# EAGLE design AutoPilotPanel - Part 1 (EAGLE 8.3.1)
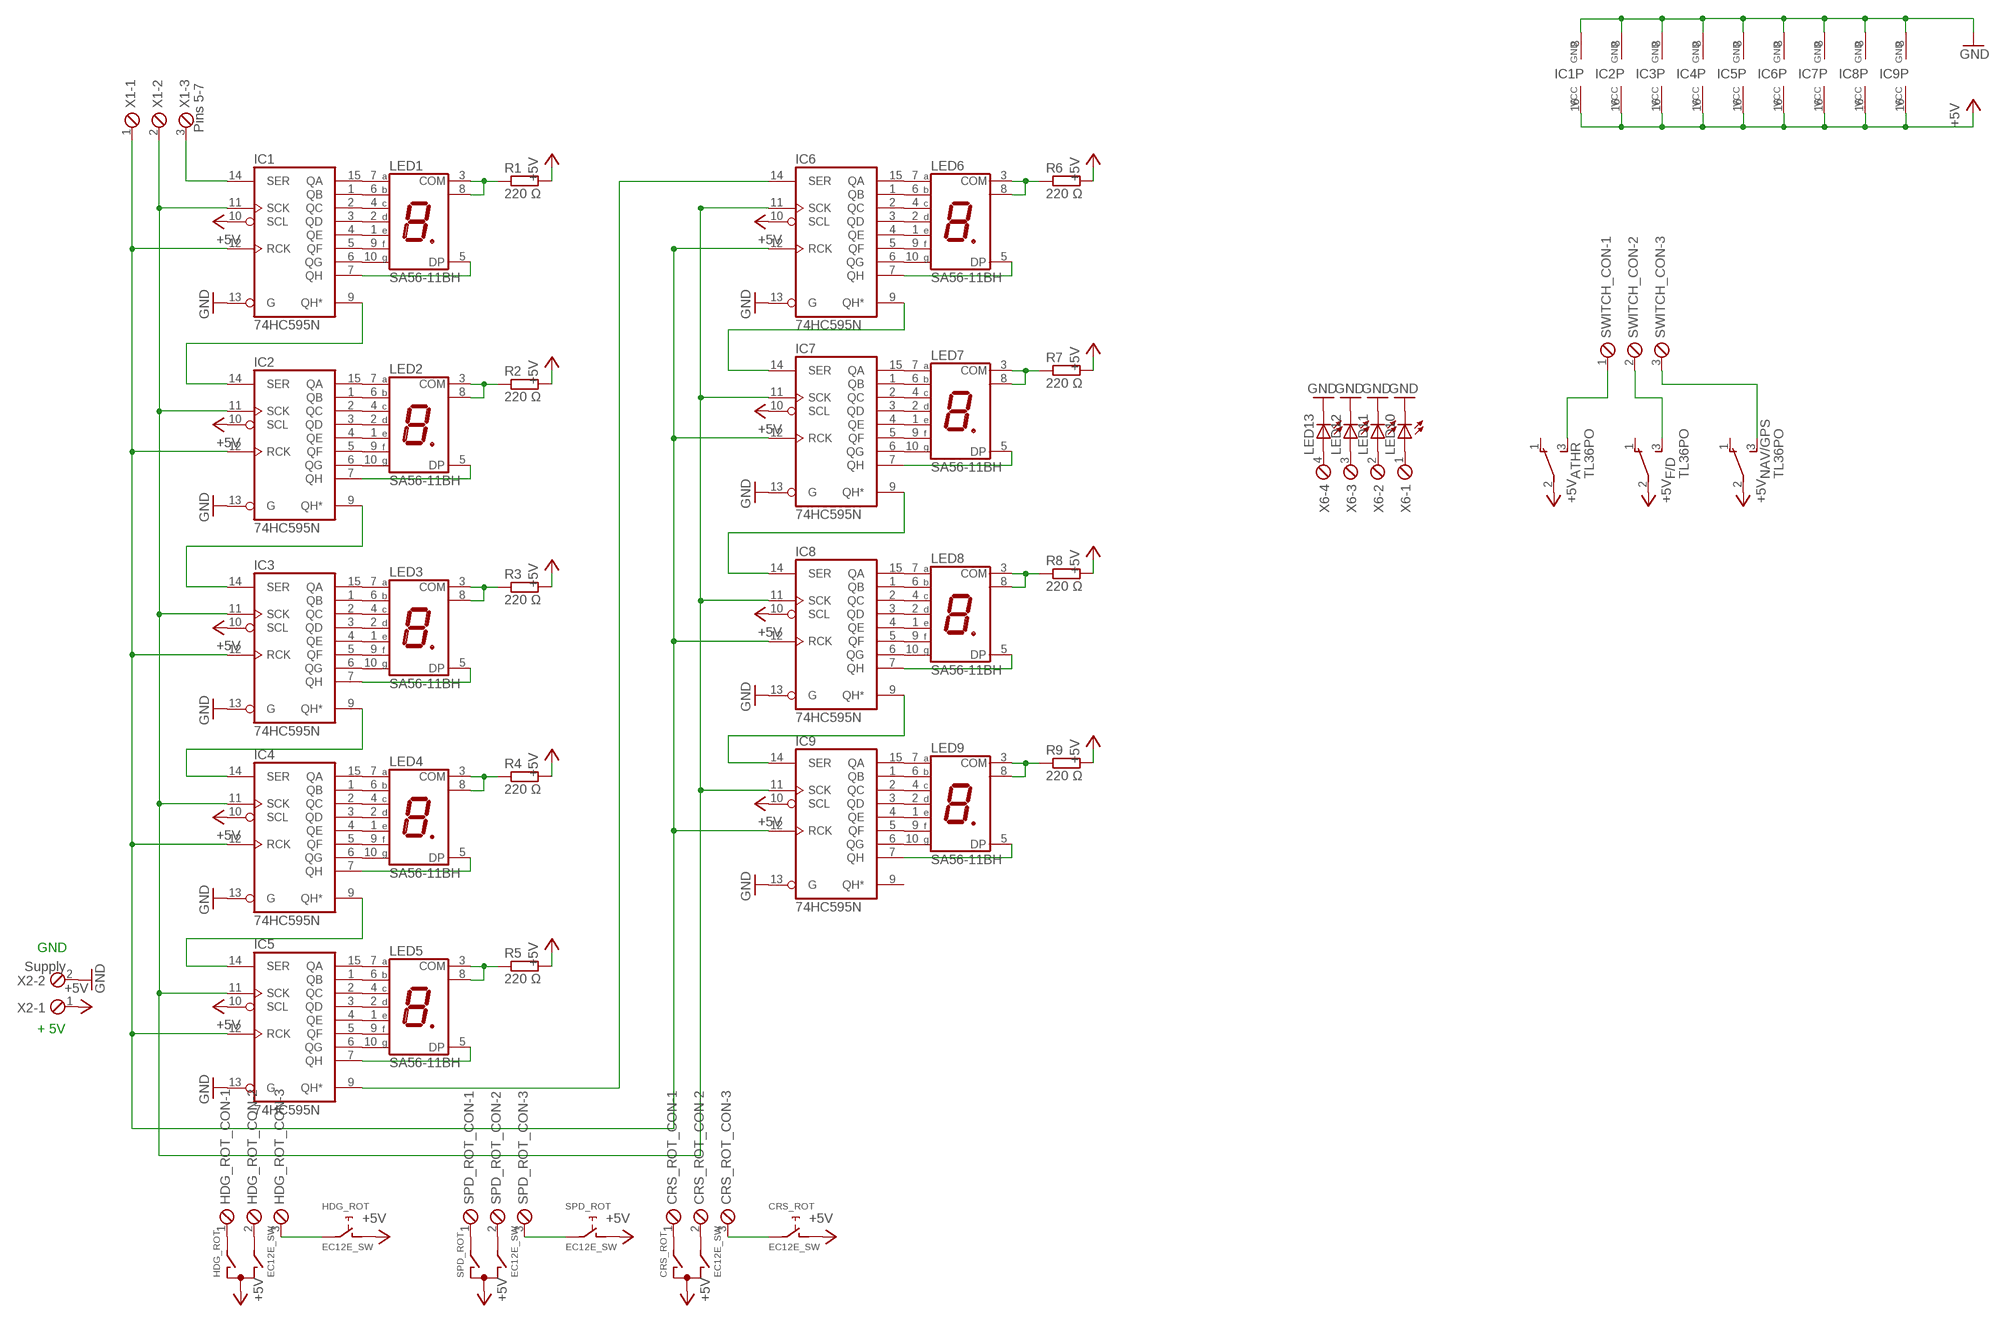
[diagram p0: schematic, sheet 1]

## Parts
ATHR  TL36PO  [TL3XPO]
CRS_ROT  EC12E_SW  [ALPS_EC12E_SW]
CRS_ROT_CON  MPT3  [3POL254]
F/D  TL36PO  [TL3XPO]
HDG_ROT  EC12E_SW  [ALPS_EC12E_SW]
HDG_ROT_CON  MPT3  [3POL254]
IC1  74HC595N  [DIL16]
IC2  74HC595N  [DIL16]
IC3  74HC595N  [DIL16]
IC4  74HC595N  [DIL16]
IC5  74HC595N  [DIL16]
IC6  74HC595N  [DIL16]
IC7  74HC595N  [DIL16]
IC8  74HC595N  [DIL16]
IC9  74HC595N  [DIL16]
LED1  SA56-11BH  7-SEG_SA56-11  [SA56-11]
LED2  SA56-11BH  7-SEG_SA56-11  [SA56-11]
LED3  SA56-11BH  7-SEG_SA56-11  [SA56-11]
LED4  SA56-11BH  7-SEG_SA56-11  [SA56-11]
LED5  SA56-11BH  7-SEG_SA56-11  [SA56-11]
LED6  SA56-11BH  7-SEG_SA56-11  [SA56-11]
LED7  SA56-11BH  7-SEG_SA56-11  [SA56-11]
LED8  SA56-11BH  7-SEG_SA56-11  [SA56-11]
LED9  SA56-11BH  7-SEG_SA56-11  [SA56-11]
LED10  LED5MM  [LED5MM]
LED11  LED5MM  [LED5MM]
LED12  LED5MM  [LED5MM]
LED13  LED5MM  [LED5MM]
NAV/GPS  TL36PO  [TL3XPO]
R1  220 Ω  R-EU_0207/12  [0207/12]
R2  220 Ω  R-EU_0207/12  [0207/12]
R3  220 Ω  R-EU_0207/12  [0207/12]
R4  220 Ω  R-EU_0207/12  [0207/12]
R5  220 Ω  R-EU_0207/12  [0207/12]
R6  220 Ω  R-EU_0207/12  [0207/12]
R7  220 Ω  R-EU_0207/12  [0207/12]
R8  220 Ω  R-EU_0207/12  [0207/12]
R9  220 Ω  R-EU_0207/12  [0207/12]
SPD_ROT  EC12E_SW  [ALPS_EC12E_SW]
SPD_ROT_CON  MPT3  [3POL254]
SWITCH_CON  MPT3  [3POL254]
X1  Pins 5-7  MPT3  [3POL254]
X2  Supply  MPT2  [2POL254]
X6  MPT4  [4POL254]

## Nets
+5V: ATHR.2(P) CRS_ROT.C CRS_ROT.D F/D.2(P) HDG_ROT.C HDG_ROT.D IC1.10(SCL) IC1.16(VCC) IC2.10(SCL) IC2.16(VCC) IC3.10(SCL) IC3.16(VCC) IC4.10(SCL) IC4.16(VCC) IC5.10(SCL) IC5.16(VCC) IC6.10(SCL) IC6.16(VCC) IC7.10(SCL) IC7.16(VCC) IC8.10(SCL) IC8.16(VCC) IC9.10(SCL) IC9.16(VCC) NAV/GPS.2(P) R1.2 R2.2 R3.2 R4.2 R5.2 R6.2 R7.2 R8.2 R9.2 SPD_ROT.C SPD_ROT.D X2.1
GND: IC1.8(GND) IC1.13(G) IC2.8(GND) IC2.13(G) IC3.8(GND) IC3.13(G) IC4.8(GND) IC4.13(G) IC5.8(GND) IC5.13(G) IC6.8(GND) IC6.13(G) IC7.8(GND) IC7.13(G) IC8.8(GND) IC8.13(G) IC9.8(GND) IC9.13(G) LED10.K(C) LED11.K(C) LED12.K(C) LED13.K(C) X2.2
N$1: IC1.5(QF) LED1.9(F)
N$2: IC1.3(QD) LED1.2(D)
N$3: IC1.1(QB) LED1.6(B)
N$4: IC1.15(QA) LED1.7(A)
N$5: IC1.2(QC) LED1.4(C)
N$6: IC1.4(QE) LED1.1(E)
N$7: IC1.6(QG) LED1.10(G)
N$8: IC2.5(QF) LED2.9(F)
N$9: IC1.7(QH) LED1.5(DP)
N$10: IC2.3(QD) LED2.2(D)
N$11: IC2.1(QB) LED2.6(B)
N$12: IC1.14(SER) X1.3
N$13: IC1.11(SCK) IC2.11(SCK) IC3.11(SCK) IC4.11(SCK) IC5.11(SCK) IC6.11(SCK) IC7.11(SCK) IC8.11(SCK) IC9.11(SCK) X1.2
N$14: IC1.12(RCK) IC2.12(RCK) IC3.12(RCK) IC4.12(RCK) IC5.12(RCK) IC6.12(RCK) IC7.12(RCK) IC8.12(RCK) IC9.12(RCK) X1.1
N$15: LED1.3(COM) LED1.8(COM) R1.1
N$16: IC2.15(QA) LED2.7(A)
N$17: IC2.2(QC) LED2.4(C)
N$18: IC2.4(QE) LED2.1(E)
N$19: IC2.6(QG) LED2.10(G)
N$20: IC3.5(QF) LED3.9(F)
N$21: IC3.3(QD) LED3.2(D)
N$22: IC2.7(QH) LED2.5(DP)
N$23: IC1.9(QH*) IC2.14(SER)
N$24: IC3.1(QB) LED3.6(B)
N$25: IC3.15(QA) LED3.7(A)
N$26: LED2.3(COM) LED2.8(COM) R2.1
N$27: IC3.2(QC) LED3.4(C)
N$28: IC3.4(QE) LED3.1(E)
N$29: IC3.6(QG) LED3.10(G)
N$30: IC4.5(QF) LED4.9(F)
N$31: IC4.3(QD) LED4.2(D)
N$32: IC4.1(QB) LED4.6(B)
N$33: IC4.15(QA) LED4.7(A)
N$34: IC4.2(QC) LED4.4(C)
N$35: IC4.4(QE) LED4.1(E)
N$36: IC4.6(QG) LED4.10(G)
N$37: IC5.5(QF) LED5.9(F)
N$38: IC5.3(QD) LED5.2(D)
N$39: IC5.1(QB) LED5.6(B)
N$40: IC5.15(QA) LED5.7(A)
N$41: IC5.2(QC) LED5.4(C)
N$42: IC3.7(QH) LED3.5(DP)
N$43: IC2.9(QH*) IC3.14(SER)
N$44: IC5.4(QE) LED5.1(E)
N$45: IC5.6(QG) LED5.10(G)
N$46: LED3.3(COM) LED3.8(COM) R3.1
N$47: IC6.5(QF) LED6.9(F)
N$48: IC6.3(QD) LED6.2(D)
N$49: IC6.1(QB) LED6.6(B)
N$50: IC6.15(QA) LED6.7(A)
N$51: IC6.2(QC) LED6.4(C)
N$52: IC6.4(QE) LED6.1(E)
N$53: IC6.6(QG) LED6.10(G)
N$54: IC7.5(QF) LED7.9(F)
N$55: IC7.3(QD) LED7.2(D)
N$56: IC7.1(QB) LED7.6(B)
N$57: IC7.15(QA) LED7.7(A)
N$58: IC7.2(QC) LED7.4(C)
N$59: IC7.4(QE) LED7.1(E)
N$60: IC7.6(QG) LED7.10(G)
N$61: IC8.5(QF) LED8.9(F)
N$62: IC4.7(QH) LED4.5(DP)
N$63: IC3.9(QH*) IC4.14(SER)
N$64: IC8.3(QD) LED8.2(D)
N$65: IC8.1(QB) LED8.6(B)
N$66: LED4.3(COM) LED4.8(COM) R4.1
N$67: IC8.15(QA) LED8.7(A)
N$68: IC8.2(QC) LED8.4(C)
N$69: IC8.4(QE) LED8.1(E)
N$70: IC8.6(QG) LED8.10(G)
N$71: IC9.5(QF) LED9.9(F)
N$72: IC9.3(QD) LED9.2(D)
N$73: IC9.1(QB) LED9.6(B)
N$74: IC9.15(QA) LED9.7(A)
N$75: IC9.2(QC) LED9.4(C)
N$76: IC9.4(QE) LED9.1(E)
N$77: IC9.6(QG) LED9.10(G)
N$78: LED10.A X6.1
N$79: LED11.A X6.2
N$80: LED12.A X6.3
N$81: LED13.A X6.4
N$82: IC5.7(QH) LED5.5(DP)
N$83: IC4.9(QH*) IC5.14(SER)
N$84: ATHR.3(S) SWITCH_CON.1
N$85: F/D.3(S) SWITCH_CON.2
N$86: LED5.3(COM) LED5.8(COM) R5.1
N$87: NAV/GPS.3(S) SWITCH_CON.3
N$88: SPD_ROT.A SPD_ROT_CON.1
N$89: SPD_ROT.B SPD_ROT_CON.2
N$90: SPD_ROT.E SPD_ROT_CON.3
N$102: IC6.7(QH) LED6.5(DP)
N$103: IC5.9(QH*) IC6.14(SER)
N$106: LED6.3(COM) LED6.8(COM) R6.1
N$109: CRS_ROT.A CRS_ROT_CON.1
N$110: CRS_ROT.B CRS_ROT_CON.2
N$122: IC7.7(QH) LED7.5(DP)
N$123: IC6.9(QH*) IC7.14(SER)
N$126: LED7.3(COM) LED7.8(COM) R7.1
N$142: IC8.7(QH) LED8.5(DP)
N$143: IC7.9(QH*) IC8.14(SER)
N$146: LED8.3(COM) LED8.8(COM) R8.1
N$162: IC9.7(QH) LED9.5(DP)
N$163: IC8.9(QH*) IC9.14(SER)
N$166: LED9.3(COM) LED9.8(COM) R9.1
N$170: CRS_ROT.E CRS_ROT_CON.3
N$210: HDG_ROT.A HDG_ROT_CON.1
N$211: HDG_ROT.B HDG_ROT_CON.2
N$212: HDG_ROT.E HDG_ROT_CON.3
Unconnected: ATHR.1(O) CRS_ROT.GND1(G) CRS_ROT.GND2(G) F/D.1(O) HDG_ROT.GND1(G) HDG_ROT.GND2(G) IC9.9(QH*) NAV/GPS.1(O) SPD_ROT.GND1(G) SPD_ROT.GND2(G)

## Notes on the sheet
- GND
- + 5V

## Library data of the parts
ATHR F/D NAV/GPS = switch:TL36PO: TINY SWITCH ON - ON Source: http://www2.produktinfo.conrad.com/datenblaetter/700000-724999/705152-da-01-de-Subminiaturschalter_TL_36YO.pdf
CRS_ROT HDG_ROT SPD_ROT = switch-alps:EC12E_SW: ALPS rotary Encoder EC12E series with switch; MPN: EC12E2424407; OC_FARNELL: 1520813; OC_NEWARK: 74M1068
CRS_ROT_CON HDG_ROT_CON SPD_ROT_CON SWITCH_CON X1 = con-phoenix-254:MPT3: PHOENIX CONNECTOR; OC_FARNELL: unknown; OC_NEWARK: unknown
IC1-IC9 = 74xx-eu:74*595: 8-bit SHIFT REGISTER, output latch
LED1-LED9 = display-kingbright:7-SEG_: Kingbright 14.2mm (0.56 INCH) SINGLE DIGIT NUMERIC DUISPLAY Source: SA56-11EWA(Ver1189471036.pdf; OC_FARNELL: unknown; OC_NEWARK: unknown
LED10-LED13 = led:LED: LED OSRAM: - CHIPLED LG R971, LG N971, LY N971, LG Q971, LY Q971, LO R971, LY R971 LH N974, LH R974 LS Q976, LO Q976, LY Q976 LO Q996 - Hyper CHIPLED LW Q18S LB Q993, LB Q99A, LB R99A - SideLED LS A670, LO A670, LY A670, LG A670, LP A670 LB A673, LV A673, LT A673, LW A673 LH A674 LY A675 LS A676, LA A676, LO A676, LY A676, LW A676 LS A679, LY A679, LG A679 - Hyper Micro SIDELED® LS Y876, LA Y876, LO Y876, LY Y876 LT Y87S - SmartLED LW L88C, LW L88S LB L89C, LB L89S, LG L890 LS L89K, LO L89K, LY L89K LS L896, LA L896, LO L896, LY L896 - TOPLED LS T670, LO T670, LY T670, LG T670, LP T670 LSG T670, LSP T670, LSY T670, LOP T670, LYG T670 LG T671, LOG T671, LSG T671 LB T673, LV T673, LT T673, LW T673 LH T674 LS T676, LA T676, LO T676, LY T676, LB T676, LH T676, LSB T676, LW T676 LB T67C, LV T67C, LT T67C, LS T67K, LO T67K, LY T67K, LW E67C LS E67B, LA E67B, LO E67B, LY E67B, LB E67C, LV E67C, LT E67C LW T67C LS T679, LY T679, LG T679 LS T770, LO T770, LY T770, LG T770, LP T770 LB T773, LV T773, LT T773, LW T773 LH T774 LS E675, LA E675, LY E675, LS T675 LS T776, LA T776, LO T776, LY T776, LB T776 LHGB T686 LT T68C, LB T68C - Hyper Mini TOPLED® LB M676 - Mini TOPLED Santana® LG M470 LS M47K, LO M47K, LY M47K Source: http://www.osram.convergy.de LUXEON: - LUMILED® LXK2-PW12-R00, LXK2-PW12-S00, LXK2-PW14-U00, LXK2-PW14-V00 LXK2-PM12-R00, LXK2-PM12-S00, LXK2-PM14-U00 LXK2-PE12-Q00, LXK2-PE12-R00, LXK2-PE12-S00, LXK2-PE14-T00, LXK2-PE14-U00 LXK2-PB12-K00, LXK2-PB12-L00, LXK2-PB12-M00, LXK2-PB14-N00, LXK2-PB14-P00, LXK2-PB14-Q00 LXK2-PR12-L00, LXK2-PR12-M00, LXK2-PR14-Q00, LXK2-PR14-R00 LXK2-PD12-Q00, LXK2-PD12-R00, LXK2-PD12-S00 LXK2-PH12-R00, LXK2-PH12-S00 LXK2-PL12-P00, LXK2-PL12-Q00, LXK2-PL12-R00 Source: www.luxeon.com KINGBRIGHT: KA-3528ASYC Source: www.kingbright.com
R1-R9 = resistor:R-EU_: RESISTOR, European symbol
X2 = con-phoenix-254:MPT2: PHOENIX CONNECTOR; OC_FARNELL: unknown; OC_NEWARK: unknown
X6 = con-phoenix-254:MPT4: PHOENIX CONNECTOR; OC_FARNELL: unknown; OC_NEWARK: unknown

## Board
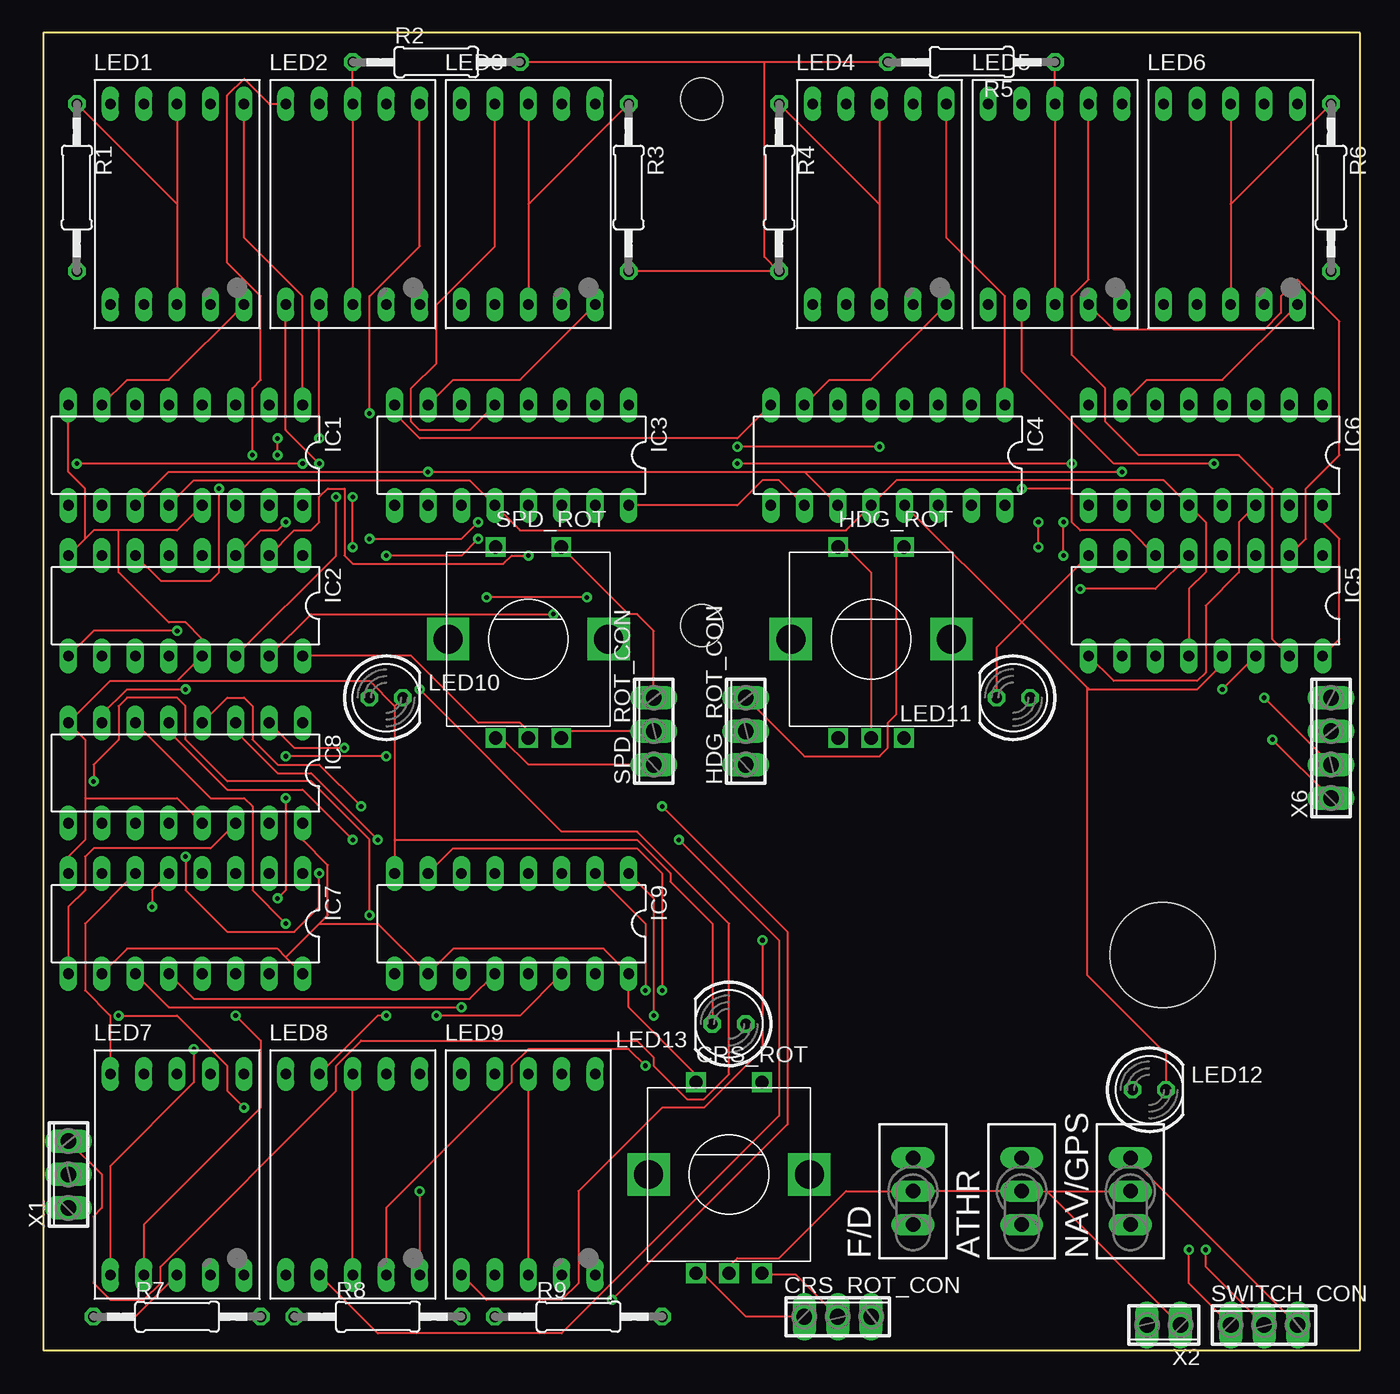
[diagram p1: board, top side]
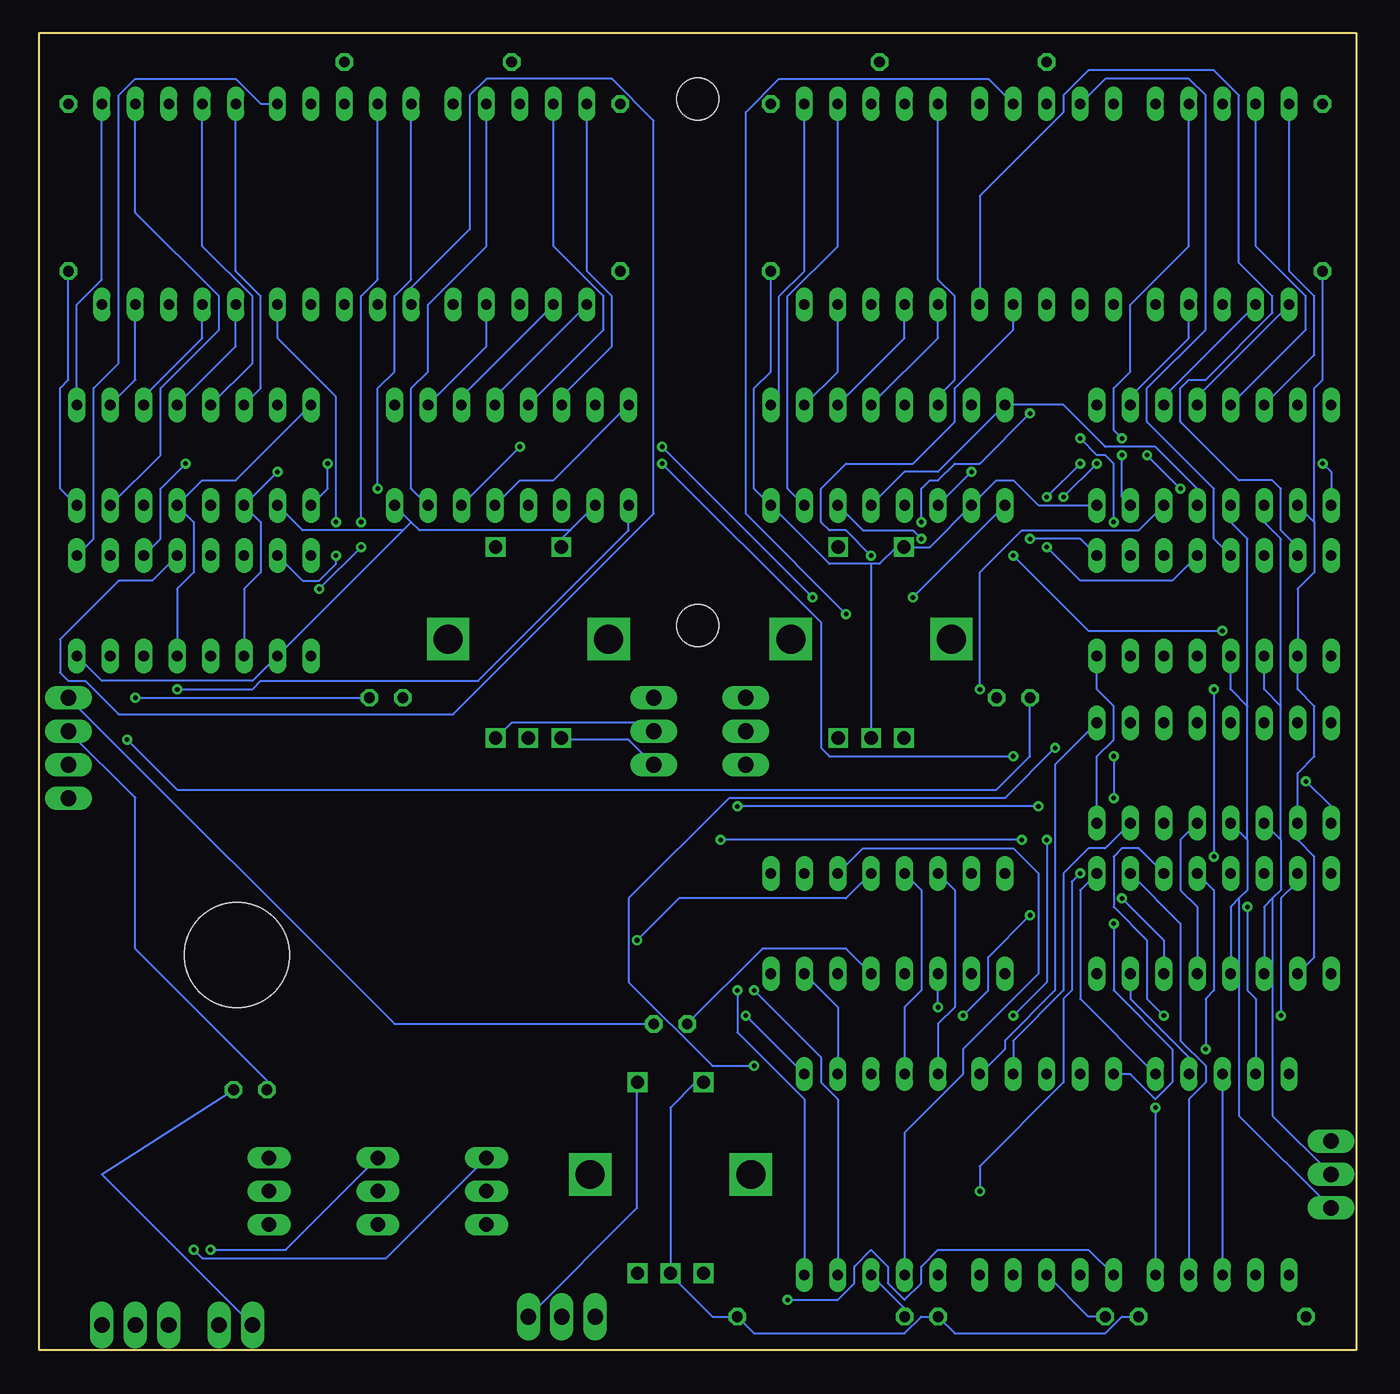
[diagram p2: board, bottom side, seen from below]

Size 100 x 100 mm. Coordinates in mm from the lower left corner, seen from the top.
Outline: 0,0 100,0 100,100 0,100 0,0
Copper layers (1*16): Top 0.035mm / dielectric 1.5mm / Bottom 0.035mm
Design rules "default": minimum track width 6mil, minimum drill 0.35mm, track to track 6mil, track to pad 6mil, pad to pad 6mil, via to via 6mil, smd to smd 6mil, copper to edge 40mil, drill to drill 6mil, minimum pad ring 10mil, minimum via ring 8mil, stop-mask expansion 4mil, vias tented up to drill 0mil, thermal gap 10mil
Holes 3.2 mm at 50,95 50,55
Holes 8 mm at 85,30

### Footprints (pad centres in the part's own frame; a part is rotated, then mirrored left to right if it is on the bottom)
TL3XPO = drill 1.1 pad 1.422 long: 1 -2.54,0; 2 0,0; 3 2.54,0
ALPS_EC12E_SW = drill 1 square: A -2.5,-7.5; B 2.5,-7.5; C 0,-7.5; D -2.5,7; E 2.5,7 | drill 2.2 square: GND1 -6.1,0; GND2 6.1,0
3POL254 = drill 1.2 long: 1 -2.54,0; 2 0,0; 3 2.54,0
DIL16 = drill 0.813 long: 1 -8.89,-3.81; 2 -6.35,-3.81; 3 -3.81,-3.81; 4 -1.27,-3.81; 5 1.27,-3.81; 6 3.81,-3.81; 7 6.35,-3.81; 8 8.89,-3.81; 9 8.89,3.81; 10 6.35,3.81; 11 3.81,3.81; 12 1.27,3.81; 13 -1.27,3.81; 14 -3.81,3.81; 15 -6.35,3.81; 16 -8.89,3.81
SA56-11 = drill 0.8 long: 1 -5.08,-7.62; 2 -2.54,-7.62; 3 0,-7.62; 4 2.54,-7.62; 5 5.08,-7.62; 6 5.08,7.62; 7 2.54,7.62; 8 0,7.62; 9 -2.54,7.62; 10 -5.08,7.62
LED5MM = drill 0.813 octagon: A -1.27,0; K 1.27,0
0207/12 = drill 0.813 octagon: 1 -6.35,0; 2 6.35,0
2POL254 = drill 1.2 long: 1 -1.27,0; 2 1.27,0
4POL254 = drill 1.2 long: 1 -3.81,0; 2 -1.27,0; 3 1.27,0; 4 3.81,0

### Placement (x,y rotation side)
ATHR  74.3,12.06 90 top
CRS_ROT  52.07,13.34 0 top
CRS_ROT_CON  60.33,2.54 0 top
F/D  66.04,12.06 90 top
HDG_ROT  62.87,53.98 0 top
HDG_ROT_CON  53.34,46.99 90 top
IC1  10.79,67.94 180 top
IC2  10.79,56.52 180 top
IC3  35.56,67.94 180 top
IC4  64.14,67.94 180 top
IC5  88.27,56.52 180 top
IC6  88.27,67.94 180 top
IC7  10.79,32.38 180 top
IC8  10.79,43.81 180 top
IC9  35.56,32.38 180 top
LED1  10.16,87 0 top
LED2  23.5,87 0 top
LED3  36.83,87 0 top
LED4  63.5,87 0 top
LED5  76.83,87 0 top
LED6  90.17,87 0 top
LED7  10.16,13.34 0 top
LED8  23.5,13.34 0 top
LED9  36.83,13.34 0 top
LED10  26.04,49.53 0 top
LED11  73.66,49.53 180 top
LED12  83.98,19.77 0 top
LED13  52.07,24.77 180 top
NAV/GPS  82.55,12.06 90 top
R1  2.54,88.27 270 top
R2  29.84,97.79 0 top
R3  44.45,88.27 270 top
R4  55.88,88.27 270 top
R5  70.48,97.79 180 top
R6  97.79,88.27 270 top
R7  10.16,2.54 0 top
R8  25.4,2.54 0 top
R9  40.64,2.54 0 top
SPD_ROT  36.83,53.98 0 top
SPD_ROT_CON  46.35,46.99 90 top
SWITCH_CON  92.71,1.91 0 top
X1  1.91,13.34 90 top
X2  85.09,1.91 180 top
X6  97.79,45.72 90 top

### Tracks (layer width: path | path; a pad name or v marks a point on that pad's centre or on a via)
+5V
  Top 0.152: R3.2 R4.2 55.75,82 54.75,83 54.75,97.79 | R5.2 54.75,97.79 | 54.75,97.79 R2.2 | IC2.16 27.94,52.7 33.02,47.62 36.2,47.62 36.83,46.99 SPD_ROT.C | IC6.16 97.16,62.87 98.42,61.59 98.42,53.98 IC5.16 | HDG_ROT.C 62.87,59.05 60.96,60.96 HDG_ROT.D | IC3.16 52.7,64.14 54.61,66.04 55.88,66.04 IC4.10 | IC7.10 6.35,30.48 17.78,30.48 18.41,29.84 | IC7.16 18.41,29.84 | IC8.16 19.68,38.73 21.59,36.83 21.59,33.02 20.95,32.38 | 18.41,29.84 20.95,32.38 | 20.95,32.38 25.4,32.38 IC9.10 31.11,30.48 42.55,30.48 IC9.16 44.45,26.04 49.53,20.95 CRS_ROT.D | 76.2,12.06 ATHR.2 F/D.2 60.96,12.06 55.88,6.99 52.7,6.99 52.07,6.35 CRS_ROT.C | 76.2,12.06 NAV/GPS.2 | 76.2,12.06 X2.1
  Bottom 0.152: IC1.16 24.13,64.14 26.04,66.04 27.3,66.04 IC3.10 32.38,60.96 34.29,60.96 SPD_ROT.D 34.92,60.96 36.2,59.69 36.83,59.69 | 36.83,59.69 40.01,59.69 IC3.16 45.72,65.41 45.72,73.03 44.45,74.3 R3.2 | 36.83,59.69 SPD_ROT.C | 59.69,62.23 60.33,61.59 HDG_ROT.D | 59.69,62.23 IC4.10 | 71.75,62.87 71.12,62.23 59.69,62.23 | 71.75,62.87 IC4.16 | 71.75,62.87 72.39,62.23 | 72.39,62.23 IC5.10 83.82,50.8 95.25,50.8 IC5.16 | IC6.10 80.01,62.23 72.39,62.23 | R6.2 97.79,73.66 98.42,73.03 98.42,65.41 IC6.16 | 3.17,62.87 3.17,59.05 4.45,57.78 IC2.10 4.45,50.16 3.17,48.9 3.17,45.09 4.45,43.81 IC8.10 4.45,38.73 3.17,37.47 3.17,29.84 IC7.10 | IC1.10 3.17,62.87 | R1.2 2.54,73.66 3.17,73.03 3.17,62.87 | R7.2 17.78,2.54 19.05,1.27 30.48,1.27 R8.2 33.02,2.54 34.29,1.27 45.72,1.27 R9.2 48.9,2.54 52.07,5.71 CRS_ROT.C 52.07,18.41 50.16,20.32 CRS_ROT.D | IC2.16 19.68,50.16 18.41,48.9 18.41,46.35 19.68,45.09 IC8.16
GND
  Top 0.152: 3.17,61.59 3.81,62.23 5.71,62.23 | 3.17,61.59 IC2.8 | 5.71,62.23 10.16,62.23 IC1.13 | IC1.8 1.91,66.67 3.17,65.41 3.17,61.59 | 26.67,48.9 26.67,38.73 | 26.67,38.73 IC9.8 | LED10.K 26.67,48.9 | IC7.8 1.91,37.47 3.17,38.73 3.17,41.91 | 3.17,41.91 3.17,46.35 IC8.8 5.08,50.8 10.16,50.8 | 10.16,50.8 IC2.13 12.06,53.98 10.79,55.24 9.53,55.24 5.71,59.05 5.71,62.23 | IC8.13 10.16,41.91 3.17,41.91 | 26.67,48.9 24.77,50.8 10.16,50.8 | LED13.K 50.8,32.38 47.62,35.56 47.62,36.2 45.09,38.73 26.67,38.73 | LED11.K 72.39,53.34 74.3,55.24 | IC5.8 74.3,55.24 | 74.3,55.24 IC4.13 | IC5.13 89.53,52.07 87.63,50.16 79.38,50.16 79.27,50.27 | 74.3,55.24 79.27,50.27 | IC3.8 26.67,71.12 28.57,69.22 52.7,69.22 IC4.8 | LED12.K 85.25,22.5 79.25,28.5 79.25,50.25 79.27,50.27
  Bottom 0.152: IC3.13 34.29,66.67 31.75,66.67 IC3.8 22.23,71.75 19.05,68.58 15.24,68.58 12.06,65.41 IC1.13 | LED13.K 45.09,30.48 38.73,30.48 IC9.13 | IC7.13 12.06,33.66 13.34,34.92 13.34,38.73 IC8.13 | LED12.K 95.25,13.34 X2.2 | IC5.13 89.53,57.78 88.27,59.05 88.27,62.87 IC6.13 87.63,66.04 85.09,66.04 IC6.8 | IC4.8 60.96,66.04 63.5,66.04 IC4.13
N$1
  Bottom 0.152: LED1.9 7.62,83.82 3.81,80.01 3.81,77.47 IC1.5
N$2
  Bottom 0.152: LED1.2 14.61,72.39 IC1.3
N$3
  Top 0.152: LED1.6 15.24,84.45 19.68,80.01 IC1.1
N$4  (via drill 0.35)
  Top 0.152: v17.78,67.94 v17.78,69.22
  Bottom 0.152: LED1.7 12.7,83.82 17.14,79.38 17.14,74.3 18.41,73.03 18.41,69.85 v17.78,69.22 | v17.78,67.94 17.78,64.77 IC1.15
N$5
  Bottom 0.152: LED1.4 12.7,76.83 17.14,72.39 IC1.2
N$6
  Bottom 0.152: LED1.1 12.06,72.39 IC1.4
N$7
  Bottom 0.152: LED1.10 5.08,81.92 3.17,80.01 3.17,75.56 IC1.6
N$8
  Bottom 0.152: LED2.9 19.05,96.52 12.7,96.52 11.43,95.25 11.43,77.47 15.88,73.03 15.88,70.48 10.79,65.41 10.79,61.59 IC2.5
N$9
  Top 0.152: LED1.5 9.53,73.66 6.35,73.66 IC1.7
N$10  (via drill 0.35)
  Top 0.152: v20.95,69.22 LED2.2 | v18.41,62.87 17.78,62.23 16.51,62.23 IC2.3
  Bottom 0.152: v20.95,69.22 19.68,67.94 19.05,67.94 18.41,67.31 v18.41,62.87
N$11  (via drill 0.35)
  Top 0.152: LED2.6 28.57,83.82 24.77,80.01 v24.77,71.12 | v33.02,62.87 31.75,61.59 v24.77,61.59
  Bottom 0.152: v24.77,71.12 28.57,67.31 30.48,67.31 31.75,66.04 32.38,66.04 33.02,65.41 v33.02,62.87 | v24.77,61.59 20.95,61.59 IC2.1
N$12  (via drill 0.35)
  Top 0.152: v28.57,50.16 39.37,39.37 45.09,39.37 52.07,32.38 52.07,20.95 50.16,19.05 48.9,19.05 46.35,21.59 46.35,22.23 45.09,23.5 24.13,23.5 22.23,21.59 22.23,19.68 8.89,6.35 8.89,5.08 7.62,3.81 5.08,3.81 3.81,5.08 3.81,10.16 4.45,10.79 4.45,13.34 X1.3
  Bottom 0.152: IC1.14 16.51,62.23 25.4,62.23 28.57,59.05 v28.57,50.16
N$13  (via drill 0.35)
  Top 0.152: v31.75,26.04 9.53,26.04 IC7.11 | IC1.11 9.53,66.67 v29.21,66.67 57.78,66.67 | 57.78,66.67 IC4.11 | 57.78,66.67 v81.92,66.67
  Bottom 0.152: IC5.11 84.45,57.78 83.19,59.05 83.19,62.87 IC6.11 v81.92,66.67 | IC7.11 6.99,33.66 6.35,34.29 | 6.35,34.29 5.71,34.92 5.71,38.73 | IC8.11 5.71,38.73 | IC2.11 6.99,50.16 5.71,48.9 | 5.71,38.73 5.71,48.9 | v31.75,26.04 IC9.11 | IC1.11 6.99,62.87 5.71,61.59 5.71,48.9 | v29.21,66.67 IC3.11 | X1.2 6.35,17.78 6.35,34.29
N$14
  Top 0.152: IC5.12 87,57.78 88.27,59.05 88.27,62.87 IC6.12 85.09,66.04 64.77,66.04 IC4.12 60.96,62.23 36.2,62.23 IC3.12 32.38,66.04 11.43,66.04 IC1.12 | IC9.12 32.38,26.67 11.43,26.67 IC7.12
  Bottom 0.152: IC7.12 9.53,33.66 8.89,34.29 | 8.89,34.29 8.26,34.92 8.26,38.73 | IC8.12 8.26,38.73 | IC2.12 9.53,50.16 8.26,48.9 | 8.26,38.73 8.26,48.9 | IC1.12 9.53,62.87 8.26,61.59 8.26,48.9 | X1.1 8.89,17.78 8.89,34.29
N$15
  Top 0.152: LED1.8 10.16,87 | 10.16,87 LED1.3 | 10.16,87 R1.1
N$16  (via drill 0.35)
  Top 0.152: v38.73,55.88 20.32,55.88 IC2.15
  Bottom 0.152: LED2.7 27.94,96.52 43.81,96.52 46.35,93.98 46.35,63.5 v38.73,55.88
N$17  (via drill 0.35)
  Top 0.152: v36.83,60.33 35.56,60.33 34.92,59.69 23.5,59.69 22.86,60.33 22.86,65.41 21.59,65.41 20.95,64.77 20.95,62.87 20.32,62.23 19.05,62.23 IC2.2
  Bottom 0.152: LED2.4 26.04,77.47 30.48,73.03 30.48,70.48 33.66,67.31 38.73,67.31 40.64,65.41 40.64,62.87 40.01,62.23 38.73,62.23 v36.83,60.33
N$18  (via drill 0.35)
  Top 0.152: LED2.1 18.41,69.85 v20.95,67.31 | v23.5,60.96 v23.5,64.77
  Bottom 0.152: v23.5,64.77 v20.95,67.31 | v23.5,60.96 20.95,58.42 13.97,58.42 IC2.4
N$19  (via drill 0.35)
  Top 0.152: LED2.10 17.14,94.61 15.24,96.52 13.97,95.25 13.97,82.55 16.51,80.01 16.51,73.66 15.88,73.03 v15.88,67.94 | v13.34,65.41 13.34,59.05 12.7,58.42 8.89,58.42 IC2.6
  Bottom 0.152: v13.34,65.41 v15.88,67.94
N$20
  Top 0.152: LED3.9 34.29,83.82 29.84,79.38 29.84,74.93 27.94,73.03 27.94,70.48 28.57,69.85 32.38,69.85 IC3.5
N$21
  Bottom 0.152: LED3.2 34.29,76.83 IC3.3
N$22
  Bottom 0.152: LED2.5 28.57,87.63 22.23,93.98 22.23,95.25 20.32,97.16 10.79,97.16 8.89,95.25 8.89,82.55 6.35,80.01 6.35,78.74 11.43,73.66 12.7,73.66 13.34,73.03 13.34,70.48 8.89,66.04 6.35,66.04 5.71,65.41 5.71,62.23 4.45,60.96 IC2.7
N$23  (via drill 0.35)
  Top 0.152: v19.68,67.31 v2.54,67.31 | v22.23,64.77 22.23,60.33 IC2.14
  Bottom 0.152: IC1.9 1.91,66.67 v2.54,67.31 | v22.23,64.77 v19.68,67.31
N$24
  Bottom 0.152: LED3.6 41.91,81.92 43.81,80.01 43.81,72.39 IC3.1
N$25
  Bottom 0.152: LED3.7 39.37,83.82 43.18,80.01 43.18,65.41 IC3.15
N$26
  Top 0.152: LED2.3 LED2.8 R2.1
N$27
  Bottom 0.152: LED3.4 39.37,74.3 IC3.2
N$28
  Bottom 0.152: LED3.1 31.75,76.83 IC3.4
N$29
  Bottom 0.152: LED3.10 31.75,81.28 30.48,80.01 30.48,73.66 31.75,72.39 IC3.6
N$30
  Bottom 0.152: LED4.9 60.96,83.82 57.15,80.01 57.15,77.47 IC4.5
N$31
  Bottom 0.152: LED4.2 67.94,72.39 IC4.3
N$32
  Top 0.152: LED4.6 68.58,84.45 73.03,80.01 IC4.1
N$33
  Bottom 0.152: LED4.7 66.04,83.82 70.48,79.38 70.48,74.3 71.75,73.03 71.75,65.41 IC4.15
N$34
  Bottom 0.152: LED4.4 66.04,76.2 IC4.2
N$35
  Bottom 0.152: LED4.1 65.41,72.39 IC4.4
N$36
  Bottom 0.152: LED4.10 58.42,81.92 56.52,80.01 56.52,76.2 60.33,72.39 IC4.6
N$37  (via drill 0.35)
  Top 0.152: v75.56,60.96 v75.56,62.87 | v78.74,57.78 84.45,57.78 IC5.5
  Bottom 0.152: LED5.9 74.3,81.28 75.56,80.01 v75.56,62.87 | v78.74,57.78 v75.56,60.96
N$38  (via drill 0.35)
  Top 0.152: LED5.2 74.3,74.3 81.28,67.31 v88.9,67.31
  Bottom 0.152: v88.9,67.31 90.81,65.41 90.81,61.59 IC5.3
N$39
  Bottom 0.152: LED5.6 83.19,94.61 85.09,96.52 92.71,96.52 93.98,95.25 93.98,74.93 95.89,73.03 95.89,61.59 IC5.1
N$40
  Top 0.152: LED5.7 79.38,81.28 78.11,80.01 78.11,75.56 80.64,73.03 80.64,70.48 83.19,67.94 90.81,67.94 93.34,65.41 93.34,53.98 IC5.15
N$41
  Top 0.152: LED5.4 81.28,77.47 92.71,77.47 93.98,78.74 93.98,80.01 95.25,81.28 98.42,78.11 98.42,67.94 95.89,65.41 95.89,61.59 IC5.2
N$42
  Top 0.152: LED3.5 36.2,73.66 31.11,73.66 IC3.7
N$43  (via drill 0.35)
  Top 0.152: IC2.9 3.81,54.61 v10.16,54.61 | v26.04,60.33 31.75,60.33 v33.02,61.59
  Bottom 0.152: v10.16,54.61 20.32,54.61 v26.04,60.33 | v33.02,61.59 33.66,62.23 37.47,62.23 IC3.14
N$44
  Bottom 0.152: LED5.1 71.75,80.64 67.31,85.09 67.31,95.25 66.04,96.52 56.52,96.52 53.34,93.34 53.34,63.5 68.58,48.26 93.98,48.26 96.52,50.8 97.79,50.8 98.42,51.44 98.42,53.98 93.98,58.42 91.44,58.42 IC5.4
N$45  (via drill 0.35)
  Top 0.152: v74.3,65.41 78.11,65.41 78.11,62.87 78.74,62.23 82.55,62.23 IC5.6
  Bottom 0.152: LED5.10 71.75,81.28 73.03,80.01 73.03,74.3 74.3,73.03 v74.3,65.41
N$46
  Top 0.152: LED3.8 36.83,87 | 36.83,87 LED3.3 | 36.83,87 R3.1
N$47
  Bottom 0.152: LED6.9 87.63,83.82 83.82,80.01 83.82,74.93 IC6.5
N$48
  Bottom 0.152: LED6.2 87.63,76.83 92.08,72.39 IC6.3
N$49
  Bottom 0.152: LED6.6 95.25,81.28 97.16,79.38 IC6.1
N$50
  Bottom 0.152: LED6.7 92.71,86.36 86.36,80.01 86.36,77.47 90.81,73.03 90.81,67.94 IC6.15
N$51
  Bottom 0.152: LED6.4 92.71,73.66 IC6.2
N$52
  Bottom 0.152: LED6.1 85.09,76.2 IC6.4
N$53
  Bottom 0.152: LED6.10 85.09,81.92 83.19,80.01 83.19,73.03 IC6.6
N$54  (via drill 0.35)
  Top 0.152: v8.26,33.66 8.26,34.92 IC7.5
  Bottom 0.152: LED7.9 7.62,26.67 8.26,27.3 v8.26,33.66
N$55  (via drill 0.35)
  Top 0.152: LED7.2 7.62,9.53 16.51,18.41 16.51,23.5 v14.61,25.4
  Bottom 0.152: v14.61,25.4 15.88,26.67 15.88,31.11 18.41,33.66 18.41,37.47 17.78,38.1 16.51,38.1 IC7.3
N$56
  Bottom 0.152: LED7.6 20.95,26.67 20.95,34.92 IC7.1
N$57
  Bottom 0.152: LED7.7 12.7,22.23 17.14,26.67 IC7.15
N$58
  Bottom 0.152: LED7.4 12.7,19.05 11.43,20.32 11.43,21.59 13.34,23.5 13.34,32.38 IC7.2
N$59  (via drill 0.35)
  Top 0.152: LED7.1 5.08,13.97 11.43,20.32 v11.43,22.86
  Bottom 0.152: v11.43,22.86 11.43,26.67 10.79,27.3 10.79,34.92 IC7.4
N$60
  Top 0.152: LED7.10 5.08,25.4 3.17,27.3 3.17,32.38 IC7.6
N$61  (via drill 0.35)
  Top 0.152: LED8.9 25.4,25.4 v26.04,25.4 | v23.5,38.73 19.68,42.55 13.97,42.55 9.53,46.99 IC8.5
  Bottom 0.152: v26.04,25.4 23.5,27.94 v23.5,38.73
N$62
  Top 0.152: LED4.5 62.87,73.66 59.69,73.66 IC4.7
N$63  (via drill 0.35)
  Top 0.152: v41.27,57.15 v33.66,57.15 | v63.5,68.58 v52.7,68.58
  Bottom 0.152: v33.66,57.15 IC3.9 | v52.7,68.58 v41.27,57.15 | IC4.14 v63.5,68.58
N$64  (via drill 0.35)
  Top 0.152: LED8.2 25.4,1.27 39.37,1.27 55.88,17.78 55.88,31.11 v48.26,38.73 | v25.4,38.73 20.32,43.81 17.78,43.81 14.61,46.99 IC8.3
  Bottom 0.152: v25.4,38.73 v48.26,38.73
N$65
  Bottom 0.152: LED8.6 26.67,22.86 26.67,23.5 22.86,27.3 22.86,44.45 IC8.1
N$66
  Top 0.152: LED4.8 63.5,87 | 63.5,87 LED4.3 | 63.5,87 R4.1
N$67
  Bottom 0.152: LED8.7 26.04,23.5 22.23,27.3 22.23,36.2 20.32,38.1 19.05,38.1 IC8.15
N$68  (via drill 0.35)
  Top 0.152: LED8.4 26.04,10.79 35.56,20.32 35.56,21.59 36.83,22.86 44.45,22.86 v45.72,21.59 | v22.86,45.72 19.05,45.72 IC8.2
  Bottom 0.152: v45.72,21.59 48.9,21.59 55.24,27.94 55.24,34.29 47.62,41.91 26.67,41.91 v22.86,45.72
N$69  (via drill 0.35)
  Top 0.152: v43.18,3.81 56.52,17.14 56.52,31.75 v46.99,41.27 | v24.13,41.27 20.95,44.45 17.78,44.45 15.88,46.35 15.88,48.9 15.24,49.53 13.97,49.53 IC8.4
  Bottom 0.152: LED8.1 20.32,7.62 31.75,7.62 33.02,6.35 33.02,5.08 34.29,3.81 35.56,5.08 35.56,6.35 36.83,7.62 38.1,6.35 38.1,5.08 39.37,3.81 v43.18,3.81 | v24.13,41.27 v46.99,41.27
N$70  (via drill 0.35)
  Top 0.152: v18.41,32.38 15.88,34.92 15.88,41.27 15.24,41.91 12.7,41.91 IC8.6
  Bottom 0.152: LED8.10 17.14,20.95 15.24,19.05 13.97,20.32 13.97,22.86 18.41,27.3 v18.41,32.38
N$71
  Bottom 0.152: LED9.9 34.29,26.04 33.02,27.3 33.02,34.92 IC9.5
N$72
  Bottom 0.152: LED9.2 34.29,16.51 29.84,20.95 29.84,22.86 24.13,28.57 24.13,36.2 26.04,38.1 37.47,38.1 IC9.3
N$73  (via drill 0.35)
  Top 0.152: v46.35,25.4 46.35,34.29 IC9.1
  Bottom 0.152: v46.35,25.4 LED9.6
N$74
  Bottom 0.152: LED9.7 39.37,26.04 IC9.15
N$75  (via drill 0.35)
  Top 0.152: v45.72,27.3 45.72,32.38 IC9.2
  Bottom 0.152: LED9.4 39.37,19.05 40.64,20.32 40.64,22.23 v45.72,27.3
N$76  (via drill 0.35)
  Top 0.152: LED9.1 33.66,3.81 39.37,3.81 40.64,5.08 40.64,12.06 46.99,18.41 50.16,18.41 54.61,22.86 v54.61,31.11
  Bottom 0.152: v54.61,31.11 51.44,34.29 38.73,34.29 IC9.4
N$77
  Bottom 0.152: LED9.10 31.75,24.77 30.48,26.04 30.48,34.92 IC9.6
N$78  (via drill 0.35)
  Top 0.152: X6.1 v93.34,46.35
  Bottom 0.152: LED10.A 24.77,45.09 27.3,42.55 89.53,42.55 v93.34,46.35
N$79  (via drill 0.35)
  Top 0.152: X6.2 v92.71,49.53
  Bottom 0.152: v92.71,49.53 LED11.A
N$80
  Bottom 0.152: X6.3 92.78,41.98 | 92.78,41.98 92.71,41.91 | LED12.A 82.75,20 82.75,20.5 92.75,30.5 92.75,42 92.78,41.98
N$81
  Bottom 0.152: LED13.A 73.03,24.77 X6.4
N$82  (via drill 0.35)
  Top 0.152: v77.47,60.33 v77.47,62.87
  Bottom 0.152: LED5.5 81.92,76.83 77.47,72.39 v77.47,62.87 | v77.47,60.33 77.47,59.69 78.74,58.42 80.01,58.42 IC5.7
N$83  (via drill 0.35)
  Top 0.152: IC5.14 v89.53,50.16
  Bottom 0.152: IC4.9 55.24,62.23 66.67,50.8 83.19,50.8 83.82,50.16 v89.53,50.16
N$84  (via drill 0.35)
  Top 0.152: v87,7.62 87,5.08 SWITCH_CON.1
  Bottom 0.152: ATHR.3 81.28,7.62 v87,7.62
N$85  (via drill 0.35)
  Top 0.152: v88.27,7.62 88.27,6.35 SWITCH_CON.2
  Bottom 0.152: F/D.3 73.66,6.99 87.63,6.99 v88.27,7.62
N$86
  Top 0.152: LED5.3 LED5.8 R5.1
N$87
  Top 0.152: SWITCH_CON.3 NAV/GPS.3
N$88
  Top 0.152: SPD_ROT_CON.1 36.83,44.45 34.92,46.35 SPD_ROT.A
N$89
  Top 0.152: SPD_ROT_CON.2 39.37,46.99 SPD_ROT.B
N$90
  Top 0.152: SPD_ROT_CON.3 46.35,54.61 45.09,55.88 44.45,55.88 39.37,60.96 SPD_ROT.E
N$102
  Top 0.152: LED6.5 89.53,73.66 83.82,73.66 IC6.7
N$103
  Top 0.152: IC5.9 81.28,50.8 87.63,50.8 88.27,51.44 88.27,56.52 90.81,59.05 90.81,62.87 IC6.14
N$106
  Top 0.152: LED6.8 90.17,87 | 90.17,87 LED6.3 | 90.17,87 R6.1
N$109
  Top 0.152: CRS_ROT_CON.1 53.34,2.54 50.16,5.71 CRS_ROT.A
N$110
  Top 0.152: CRS_ROT_CON.2 57.15,5.71 54.61,5.71 CRS_ROT.B
N$122  (via drill 0.35)
  Top 0.152: v15.24,18.41 13.97,19.68 13.97,21.59 10.16,25.4 v5.71,25.4
  Bottom 0.152: v15.24,18.41 LED7.5 | v5.71,25.4 5.71,34.29 4.45,35.56 IC7.7
N$123  (via drill 0.35)
  Top 0.152: v17.78,34.29 18.41,34.92 v18.41,41.91 | v26.04,45.09 v18.41,45.09 | v78.11,67.31 v52.7,67.31
  Bottom 0.152: IC7.14 14.61,31.11 v17.78,34.29 | v18.41,45.09 v18.41,41.91 | v26.04,45.09 40.01,45.09 40.64,45.72 40.64,55.24 v52.7,67.31 | v78.11,67.31 78.11,65.41 IC6.9
N$126
  Top 0.152: R7.1 6.99,2.54 LED7.3
  Bottom 0.152: LED7.8 LED7.3
N$142  (via drill 0.35)
  Top 0.152: v28.57,12.06 LED8.5 | v20.95,36.2 20.95,33.66 19.05,31.75 13.97,31.75 10.79,34.92 v10.79,37.47 | v10.79,50.16 6.35,50.16 4.45,48.26 IC8.7
  Bottom 0.152: v28.57,12.06 28.57,13.97 22.23,20.32 22.23,26.67 21.59,27.3 21.59,35.56 v20.95,36.2 | v10.79,50.16 v10.79,37.47
N$143
  Top 0.152: IC7.9 1.91,33.66 3.17,34.92 3.17,37.47 3.81,38.1 12.7,38.1 IC8.14
N$146
  Top 0.152: LED8.3 LED8.8
  Bottom 0.152: LED8.3 20.32,2.54 R8.1
N$162  (via drill 0.35)
  Top 0.152: v46.99,27.3 46.99,36.2 45.09,38.1 31.11,38.1 IC9.7
  Bottom 0.152: LED9.5 41.91,19.05 46.99,24.13 v46.99,27.3
N$163  (via drill 0.35)
  Top 0.152: v3.81,43.18 3.81,44.45 5.71,46.35 5.71,48.9 6.35,49.53 10.16,49.53 10.79,48.9 10.79,46.35 13.97,43.18 20.32,43.18 24.77,38.73 v24.77,33.02 | v29.84,25.4 36.2,25.4 IC9.14
  Bottom 0.152: IC8.9 1.91,41.27 v3.81,43.18 | v24.77,33.02 27.94,29.84 27.94,27.3 v29.84,25.4
N$166
  Top 0.152: LED9.3 LED9.8
  Bottom 0.152: LED9.3 34.29,3.17 R9.1
N$170
  Bottom 0.152: CRS_ROT_CON.3 54.61,10.79 54.61,20.32 CRS_ROT.E
N$210
  Bottom 0.152: HDG_ROT_CON.1 55.24,46.35 60.33,46.35 HDG_ROT.A
N$211
  Bottom 0.152: HDG_ROT_CON.2 53.98,47.62 64.14,47.62 64.77,46.99 HDG_ROT.B
N$212
  Top 0.152: HDG_ROT_CON.3 57.78,45.09 63.5,45.09 64.14,45.72 64.14,47.62 64.77,48.26 64.77,60.96 HDG_ROT.E